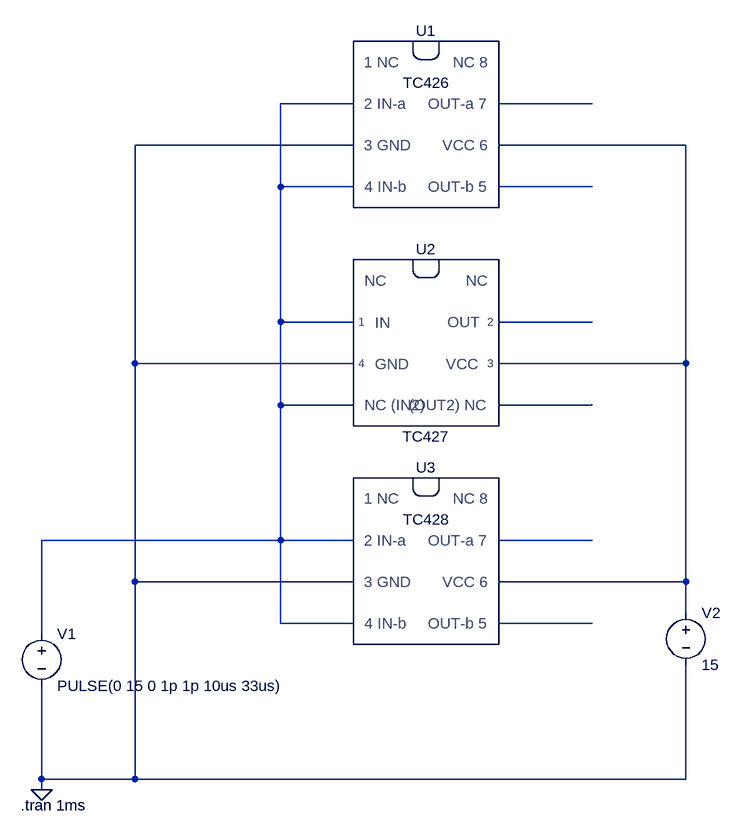
[diagram p0: schematic TC426-27-28-jig.asc]
TC426-27-28-jig.asc, the LTspice schematic file:
Version 4
SHEET 1 1160 900
WIRE 16 -512 -96 -512
WIRE 384 -512 240 -512
WIRE 16 -448 -320 -448
WIRE 528 -448 240 -448
WIRE -96 -384 -96 -512
WIRE 16 -384 -96 -384
WIRE 384 -384 240 -384
WIRE -96 -176 -96 -384
WIRE 16 -176 -96 -176
WIRE 384 -176 240 -176
WIRE -320 -112 -320 -448
WIRE 16 -112 -320 -112
WIRE 528 -112 528 -448
WIRE 528 -112 240 -112
WIRE -96 -48 -96 -176
WIRE 16 -48 -96 -48
WIRE 384 -48 240 -48
WIRE -96 160 -96 -48
WIRE -96 160 -464 160
WIRE 16 160 -96 160
WIRE 384 160 240 160
WIRE -320 224 -320 -112
WIRE 16 224 -320 224
WIRE 528 224 528 -112
WIRE 528 224 240 224
WIRE 528 272 528 224
WIRE -96 288 -96 160
WIRE 16 288 -96 288
WIRE 384 288 240 288
WIRE -464 304 -464 160
WIRE -464 528 -464 384
WIRE -320 528 -320 224
WIRE -320 528 -464 528
WIRE 528 528 528 352
WIRE 528 528 -320 528
WIRE -464 544 -464 528
FLAG -464 544 0
SYMBOL voltage -464 288 R0
WINDOW 123 0 0 Left 0
WINDOW 39 0 0 Left 0
SYMATTR InstName V1
SYMATTR Value PULSE(0 15 0 1p 1p 10us 33us)
SYMBOL voltage 528 256 R0
WINDOW 123 0 0 Left 0
WINDOW 39 0 0 Left 0
SYMATTR InstName V2
SYMATTR Value 15
SYMBOL _PERSONAL\\mosfet-drivers\\TC426 128 -480 R0
SYMATTR InstName U1
SYMBOL _PERSONAL\\mosfet-drivers\\TC427 128 -144 R0
SYMATTR InstName U2
SYMBOL _PERSONAL\\mosfet-drivers\\TC428 128 192 R0
SYMATTR InstName U3
TEXT -496 568 Left 2 !.tran 1ms

The netlist it stands for:
* TC426-27-28-jig.asc
V1 N001 0 PULSE(0 15 0 1p 1p 10us 33us)
V2 N003 0 15
XU1 N001 N002 N001 N004 N003 0 TC426 TC426 TC426  ; pins INA OUTA INB OUTB VDD VGND
XU2 N001 N005 N003 0 TC427 TC427 TC427  ; pins 1 2 3 4
XU3 N001 N007 N001 N008 N003 0 TC428 TC428 TC428  ; pins INA OUTA INB OUTB VDD VGND
.tran 1ms
.lib ..\sym\_PERSONAL\mosfet-drivers\TC4426-27-28.sub
.backanno
.end